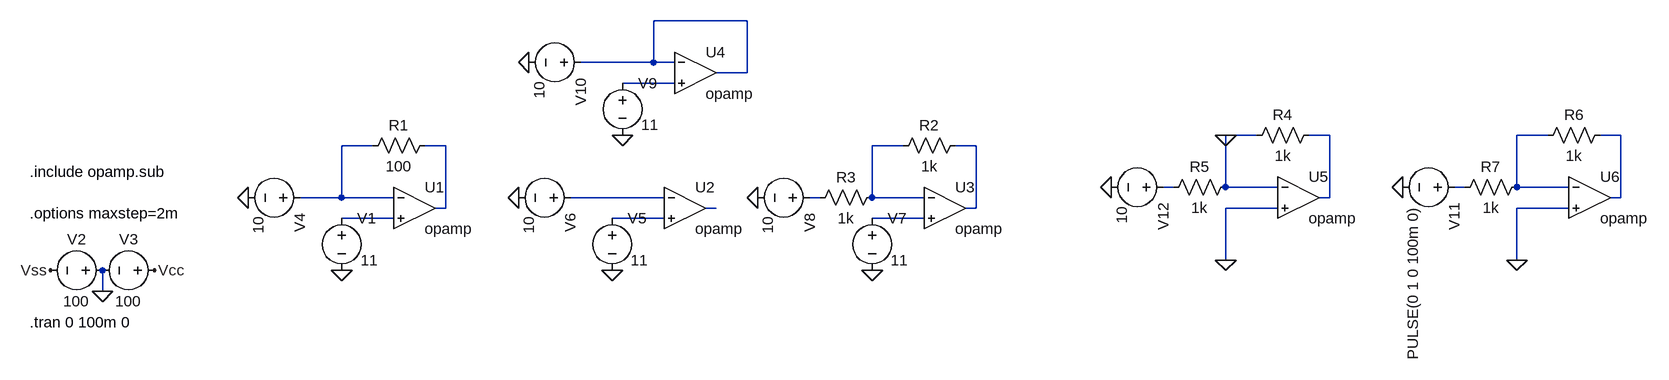
[diagram p0: schematic tem.asc]
tem.asc, the LTspice schematic file:
Version 4
SHEET 1 5108 2524
WIRE 3760 2016 3616 2016
WIRE 3616 2080 3616 2016
WIRE 3616 2080 3504 2080
WIRE 3648 2080 3616 2080
WIRE 3760 2096 3760 2016
WIRE 3760 2096 3712 2096
WIRE 3648 2112 3568 2112
WIRE 4544 2192 4496 2192
WIRE 4656 2192 4624 2192
WIRE 4992 2192 4944 2192
WIRE 5104 2192 5072 2192
WIRE 3184 2208 3136 2208
WIRE 3296 2208 3264 2208
WIRE 4000 2208 3952 2208
WIRE 4112 2208 4080 2208
WIRE 4416 2272 4400 2272
WIRE 4496 2272 4496 2192
WIRE 4576 2272 4496 2272
WIRE 4864 2272 4848 2272
WIRE 4944 2272 4944 2192
WIRE 5024 2272 4944 2272
WIRE 3136 2288 3136 2208
WIRE 3136 2288 3072 2288
WIRE 3216 2288 3136 2288
WIRE 3632 2288 3488 2288
WIRE 3872 2288 3856 2288
WIRE 3952 2288 3952 2208
WIRE 4032 2288 3952 2288
WIRE 4656 2288 4656 2192
WIRE 4656 2288 4640 2288
WIRE 5104 2288 5104 2192
WIRE 5104 2288 5088 2288
WIRE 3296 2304 3296 2208
WIRE 3296 2304 3280 2304
WIRE 3712 2304 3696 2304
WIRE 4112 2304 4112 2208
WIRE 4112 2304 4096 2304
WIRE 4576 2304 4496 2304
WIRE 5024 2304 4944 2304
WIRE 3216 2320 3136 2320
WIRE 3632 2320 3552 2320
WIRE 4032 2320 3952 2320
WIRE 4496 2384 4496 2304
WIRE 4944 2384 4944 2304
WIRE 2768 2432 2768 2400
FLAG 2768 2432 0
FLAG 2848 2400 Vcc
FLAG 2688 2400 Vss
FLAG 3136 2400 0
FLAG 2992 2288 0
FLAG 3552 2400 0
FLAG 3408 2288 0
FLAG 3952 2400 0
FLAG 3776 2288 0
FLAG 3568 2192 0
FLAG 3424 2080 0
FLAG 4496 2384 0
FLAG 4320 2272 0
FLAG 4496 2192 0
FLAG 4944 2384 0
FLAG 4768 2272 0
SYMBOL voltage 2784 2400 R90
WINDOW 0 -32 56 VBottom 2
WINDOW 3 32 56 VTop 2
WINDOW 123 0 0 Left 0
WINDOW 39 0 0 Left 0
SYMATTR InstName V2
SYMATTR Value 100
SYMBOL voltage 2864 2400 R90
WINDOW 0 -32 56 VBottom 2
WINDOW 3 32 56 VTop 2
WINDOW 123 0 0 Left 0
WINDOW 39 0 0 Left 0
SYMATTR InstName V3
SYMATTR Value 100
SYMBOL voltage 3136 2304 R0
WINDOW 3 29 80 Left 2
WINDOW 123 24 124 Left 2
WINDOW 39 0 0 Left 0
SYMATTR Value 11
SYMATTR InstName V1
SYMBOL voltage 3088 2288 R90
WINDOW 3 29 80 Left 2
WINDOW 123 24 124 Left 2
WINDOW 39 0 0 Left 0
SYMATTR Value 10
SYMATTR InstName V4
SYMBOL res 3280 2192 R90
WINDOW 0 0 56 VBottom 2
WINDOW 3 32 56 VTop 2
SYMATTR InstName R1
SYMATTR Value 100
SYMBOL OpAmps\\opamp 3248 2240 R0
SYMATTR InstName U1
SYMBOL voltage 3552 2304 R0
WINDOW 3 29 80 Left 2
WINDOW 123 24 124 Left 2
WINDOW 39 0 0 Left 0
SYMATTR Value 11
SYMATTR InstName V5
SYMBOL voltage 3504 2288 R90
WINDOW 3 29 80 Left 2
WINDOW 123 24 124 Left 2
WINDOW 39 0 0 Left 0
SYMATTR Value 10
SYMATTR InstName V6
SYMBOL OpAmps\\opamp 3664 2240 R0
SYMATTR InstName U2
SYMBOL voltage 3952 2304 R0
WINDOW 3 29 80 Left 2
WINDOW 123 24 124 Left 2
WINDOW 39 0 0 Left 0
SYMATTR Value 11
SYMATTR InstName V7
SYMBOL voltage 3872 2288 R90
WINDOW 3 29 80 Left 2
WINDOW 123 24 124 Left 2
WINDOW 39 0 0 Left 0
SYMATTR Value 10
SYMATTR InstName V8
SYMBOL res 4096 2192 R90
WINDOW 0 0 56 VBottom 2
WINDOW 3 32 56 VTop 2
SYMATTR InstName R2
SYMATTR Value 1k
SYMBOL OpAmps\\opamp 4064 2240 R0
SYMATTR InstName U3
SYMBOL res 3968 2272 R90
WINDOW 0 0 56 VBottom 2
WINDOW 3 32 56 VTop 2
SYMATTR InstName R3
SYMATTR Value 1k
SYMBOL voltage 3568 2096 R0
WINDOW 3 29 80 Left 2
WINDOW 123 24 124 Left 2
WINDOW 39 0 0 Left 0
SYMATTR Value 11
SYMATTR InstName V9
SYMBOL voltage 3520 2080 R90
WINDOW 3 29 80 Left 2
WINDOW 123 24 124 Left 2
WINDOW 39 0 0 Left 0
SYMATTR Value 10
SYMATTR InstName V10
SYMBOL OpAmps\\opamp 3680 2032 R0
SYMATTR InstName U4
SYMBOL voltage 4416 2272 R90
WINDOW 3 29 80 Left 2
WINDOW 123 24 124 Left 2
WINDOW 39 0 0 Left 0
SYMATTR Value 10
SYMATTR InstName V12
SYMBOL res 4640 2176 R90
WINDOW 0 0 56 VBottom 2
WINDOW 3 32 56 VTop 2
SYMATTR InstName R4
SYMATTR Value 1k
SYMBOL OpAmps\\opamp 4608 2224 R0
SYMATTR InstName U5
SYMBOL res 4512 2256 R90
WINDOW 0 0 56 VBottom 2
WINDOW 3 32 56 VTop 2
SYMATTR InstName R5
SYMATTR Value 1k
SYMBOL voltage 4864 2272 R90
WINDOW 3 29 80 Left 2
WINDOW 123 24 124 Left 2
WINDOW 39 0 0 Left 0
SYMATTR Value PULSE(0 1 0 100m 0)
SYMATTR InstName V11
SYMBOL res 5088 2176 R90
WINDOW 0 0 56 VBottom 2
WINDOW 3 32 56 VTop 2
SYMATTR InstName R6
SYMATTR Value 1k
SYMBOL OpAmps\\opamp 5056 2224 R0
SYMATTR InstName U6
SYMBOL res 4960 2256 R90
WINDOW 0 0 56 VBottom 2
WINDOW 3 32 56 VTop 2
SYMATTR InstName R7
SYMATTR Value 1k
TEXT 2656 2480 Left 2 !.tran 0 100m 0
TEXT 2656 2312 Left 2 !.options maxstep=2m
TEXT 2656 2248 Left 2 !.include opamp.sub

The netlist it stands for:
* tem.asc
V2 0 Vss 100
V3 Vcc 0 100
V1 N015 0 11
V4 N006 0 10
R1 N007 N006 100
XU1 N006 N015 N007 opamp Aol=100K GBW=10Meg  ; pins invin noninvin out
V5 N016 0 11
V6 N012 0 10
XU2 N012 N016 N014 opamp Aol=100K GBW=10Meg  ; pins invin noninvin out
V7 N017 0 11
V8 N013 0 10
R2 N009 N008 1k
XU3 N008 N017 N009 opamp Aol=100K GBW=10Meg  ; pins invin noninvin out
R3 N008 N013 1k
V9 N002 0 11
V10 N001 0 10
XU4 N001 N002 N001 opamp Aol=100K GBW=10Meg  ; pins invin noninvin out
V12 N010 0 10
R4 N003 0 1k
XU5 0 0 N003 opamp Aol=100K GBW=10Meg  ; pins invin noninvin out
R5 0 N010 1k
V11 N011 0 PULSE(0 1 0 100m 0)
R6 N005 N004 1k
XU6 N004 0 N005 opamp Aol=100K GBW=10Meg  ; pins invin noninvin out
R7 N004 N011 1k
.tran 0 100m 0
.options maxstep=2m
.include opamp.sub
.backanno
.end